# Altium schematic sheet LoRaSocket.SchDoc
size A
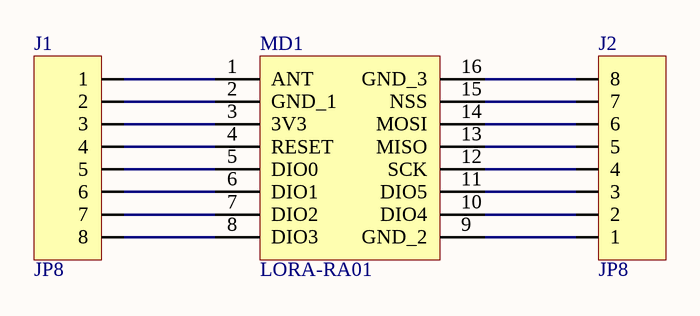
[diagram p0: LoRaSocket.SchDoc]

## Parts
J1  JP8  [JP8-D1T]
J2  JP8  [JP8-D1T]
MD1  LORA-RA01  [LORA-RA01]

## Nets
NetJ1_1: J1.1 MD1.1(ANT)
NetJ1_2: J1.2 MD1.2(GND_1)
NetJ1_3: J1.3 MD1.3(3V3)
NetJ1_4: J1.4 MD1.4(RESET)
NetJ1_5: J1.5 MD1.5(DIO0)
NetJ1_6: J1.6 MD1.6(DIO1)
NetJ1_7: J1.7 MD1.7(DIO2)
NetJ1_8: J1.8 MD1.8(DIO3)
NetJ2_1: J2.1 MD1.9(GND_2)
NetJ2_2: J2.2 MD1.10(DIO4)
NetJ2_3: J2.3 MD1.11(DIO5)
NetJ2_4: J2.4 MD1.12(SCK)
NetJ2_5: J2.5 MD1.13(MISO)
NetJ2_6: J2.6 MD1.14(MOSI)
NetJ2_7: J2.7 MD1.15(NSS)
NetJ2_8: J2.8 MD1.16(GND_3)

## Library data of the parts
J1 J2 = JP8: WR-PHD 2.54 mm Angled Socket Header; Manufacturer: W¨¹rth Elektronik eiSos GmbH; partNo: 613008143121; ComponentLink1 Description: Manufacturer; ComponentLink2 Description: Datasheet; NoPins: 08; Created Date: 29 March 2013; ComponentLink1URL: http://www.we-online.com; ComponentLink2URL: http://katalog.we-online.de/em/datasheet/6130xx143121.pdf; Created by: Karrer Zheng
MD1 = LORA-RA01: Module LoRa RA-01 SX1278